# EAGLE design PhotonIoTv2 (EAGLE 7.6.0)
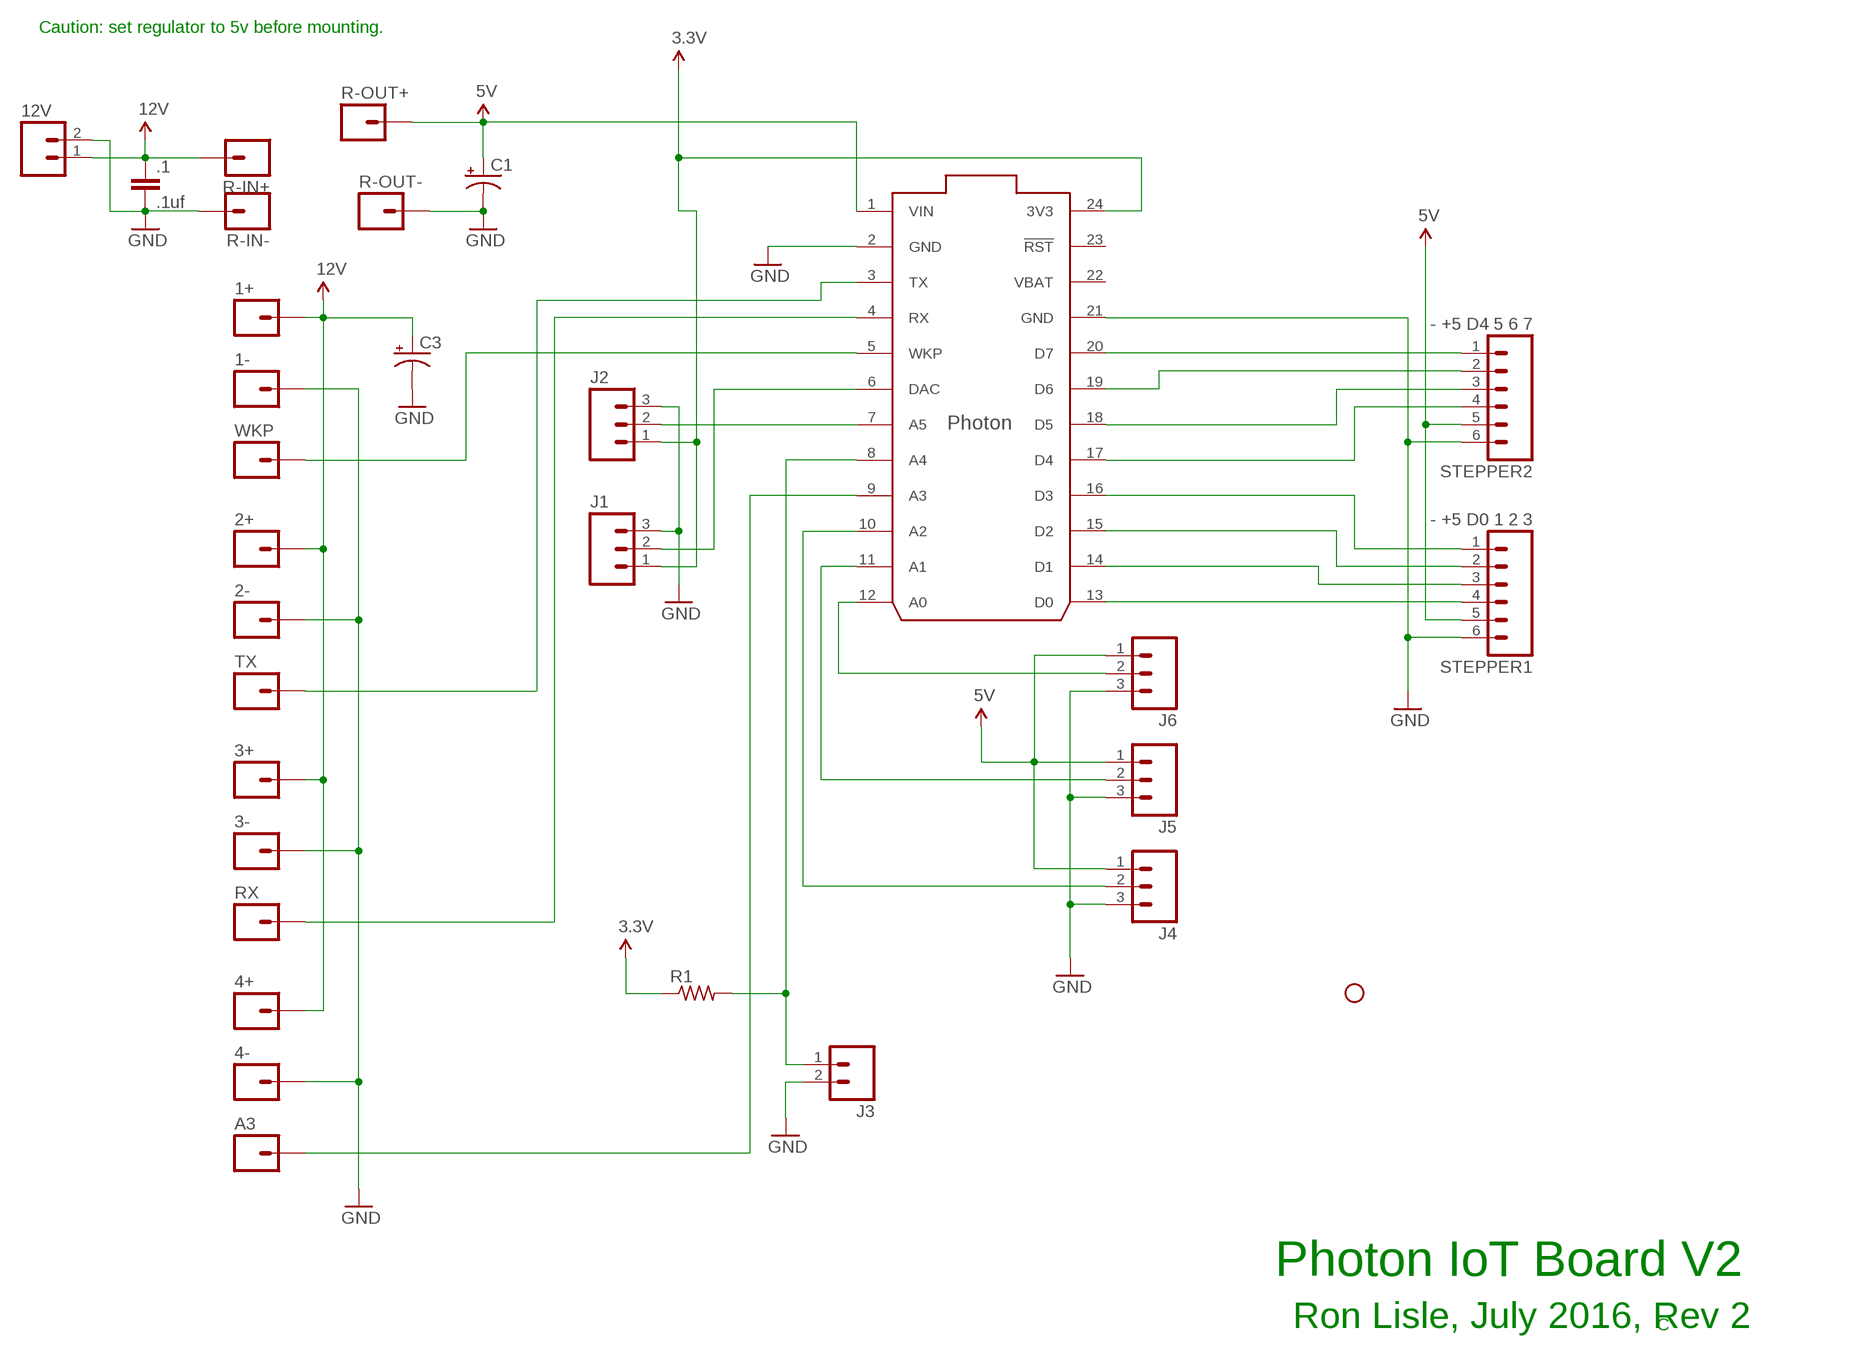
[diagram p0: schematic, sheet 1]

## Parts
1+  M01PTH  [1X01]
1-  M01PTH  [1X01]
2+  M01PTH  [1X01]
2-  M01PTH  [1X01]
3+  M01PTH  [1X01]
3-  M01PTH  [1X01]
4+  M01PTH  [1X01]
4-  M01PTH  [1X01]
12V  M025MM  [SCREWTERMINAL-5MM-2]
.1  .1uf  0.1UF-50V-20%(PTH)KIT-EZ  [CAP-PTH-SMALL-KIT]
A3  M01PTH  [1X01]
C1  10UF-25V-20%(PTH)KIT  [CPOL-RADIAL-10UF-25V-KIT]
C3  10UF-25V-20%(PTH)KIT  [CPOL-RADIAL-10UF-25V-KIT]
J1  M03PTH  [1X03]
J2  M03PTH  [1X03]
J3  M02PTH  [1X02]
J4  M03PTH  [1X03]
J5  M03PTH  [1X03]
J6  M03PTH  [1X03]
R1  R-US_0204/7  [0204/7]
R-IN+  M01PTH  [1X01]
R-IN-  M01PTH  [1X01]
R-OUT+  M01PTH  [1X01]
R-OUT-  M01PTH  [1X01]
RX  M01PTH  [1X01]
STANDOFF1  STAND-OFF  [STAND-OFF]
STEPPER1  - +5 D0 1 2 3  M06LOCK_LONGPADS  [1X06_LOCK_LONGPADS]
STEPPER2  - +5 D4 5 6 7  M06LOCK_LONGPADS  [1X06_LOCK_LONGPADS]
TX  M01PTH  [1X01]
U$1  Photon with headers  PHOTON_WITH_HEADERS  [PHOTON]
WKP  M01PTH  [1X01]

## Nets
3.3V: J1.1 J2.1 R1.1 U$1.24(3V3)
5V: C1.1(+) J4.1 J5.1 J6.1 R-OUT+.1 STEPPER1.5 STEPPER2.5 U$1.1(VIN)
12V: 1+.1 2+.1 3+.1 4+.1 12V.1 .1.1 C3.1(+) R-IN+.1
GND: 1-.1 2-.1 3-.1 4-.1 12V.2 .1.2 C1.2(-) C3.2(-) J1.3 J2.3 J3.2 J4.3 J5.3 J6.3 R-IN-.1 R-OUT-.1 STEPPER1.6 STEPPER2.6 U$1.2(GND) U$1.21(GND)
N$2: STEPPER1.2 U$1.15(D2)
N$3: STEPPER2.1 U$1.20(D7)
N$4: STEPPER2.3 U$1.18(D5)
N$5: STEPPER2.4 U$1.17(D4)
N$6: STEPPER1.1 U$1.16(D3)
N$7: A3.1 U$1.9(A3)
N$8: J4.2 U$1.10(A2)
N$9: STEPPER1.3 U$1.14(D1)
N$10: STEPPER1.4 U$1.13(D0)
N$11: U$1.5(WKP) WKP.1
N$12: J3.1 R1.2 U$1.8(A4)
N$13: J2.2 U$1.7(A5)
N$14: STEPPER2.2 U$1.19(D6)
N$15: J5.2 U$1.11(A1)
N$16: J6.2 U$1.12(A0)
N$17: J1.2 U$1.6(DAC)
N$18: TX.1 U$1.3(TX)
N$19: RX.1 U$1.4(RX)
Unconnected: U$1.23(!RST)

## Notes on the sheet
- Caution: set regulator to 5v before mounting.
- Photon IoT Board V2
- Ron Lisle, July 2016, Rev 2 | C

## Power pins joined to a net without a drawn wire
VBAT: U$1.22(VBAT)

## Library data of the parts
1+ 1- 2+ 2- 3+ 3- 4+ 4- A3 R-IN+ R-IN- R-OUT+ R-OUT- RX TX WKP = Ron:M01: Header 1 Standard 1-pin 0.1" header. Use with straight break away headers (SKU : PRT-00116), right angle break away headers (PRT-00553), swiss pins (PRT-00743), machine pins (PRT-00117), and female headers (PRT-00115). SMTSO-256-ET is a "flush mount" nut for a 4-40 screw. The older package used to be too tight, and did not allow it to sit properly thru the drill hit. The latest (0.165DIA) fits nice and snug.
12V = Ron:M02: Standard 2-pin 0.1" header. Use with - straight break away headers ( PRT-00116) - right angle break away headers (PRT-00553) - swiss pins (PRT-00743) - machine pins (PRT-00117) - female headers (PRT-00115) Molex polarized connector foot print use with: PRT-08233 with associated crimp pins and housings. 2.54_SCREWTERM for use with PRT-10571. 3.5mm Screw Terminal footprints for PRT-08084 5mm Screw Terminal footprints for use with PRT-08432; STOREFRONT_ID: PRT-08432
.1 = Ron:0.1UF-50V-20%(PTH): CAP-08370; PROD_ID: CAP-08370
C1 C3 = Ron:10UF-25V-20%(PTH): CAP-08440; PROD_ID: CAP-08440
J1 J2 J4-J6 = Ron:M03: Header 3 Standard 3-pin 0.1" header. Use with straight break away headers (SKU : PRT-00116), right angle break away headers (PRT-00553), swiss pins (PRT-00743), machine pins (PRT-00117), and female headers (PRT-00115). Molex polarized connector foot print use with SKU : PRT-08232 with associated crimp pins and housings.
J3 = Ron:M02: Standard 2-pin 0.1" header. Use with - straight break away headers ( PRT-00116) - right angle break away headers (PRT-00553) - swiss pins (PRT-00743) - machine pins (PRT-00117) - female headers (PRT-00115) Molex polarized connector foot print use with: PRT-08233 with associated crimp pins and housings. 2.54_SCREWTERM for use with PRT-10571. 3.5mm Screw Terminal footprints for PRT-08084 5mm Screw Terminal footprints for use with PRT-08432
R1 = resistor:R-US_: RESISTOR, American symbol
STANDOFF1 = Ron:STAND-OFF: #4 Stand Off This is the mechanical footprint for a #4 phillips button head screw. Use the keepout ring to avoid running the screw head into surrounding components. SKU : PRT-00447
STEPPER1 STEPPER2 = Ron:M06: Header 6 Standard 6-pin 0.1" header. Use with straight break away headers (SKU : PRT-00116), right angle break away headers (PRT-00553), swiss pins (PRT-00743), machine pins (PRT-00117), and female headers (PRT-00115). Molex polarized connector foot print use with SKU : PRT-08094 with associated crimp pins and housings. NOTES ON THE VARIANTS LOCK and LOCK_LONGPADS... This footprint was designed to help hold the alignment of a through-hole component (i.e. 6-pin header) while soldering it into place. You may notice that each hole has been shifted either up or down by 0.005 of an inch from it's more standard position (which is a perfectly straight line). This slight alteration caused the pins (the squares in the middle) to touch the edges of the holes. Because they are alternating, it causes a "brace" to hold the component in place. 0.005 has proven to be the perfect amount of "off-center" position when using our standard breakaway headers. Although looks a little odd when you look at the bare footprint, once you have a header in there, the alteration is very hard to notice. Also,if you push a header all the way into place, it is covered up entirely on the bottom side. This idea of altering the position of holes to aid alignment will be further integrated into the Sparkfun Library for other footprints. It can help hold any component with 3 or more connection pins.
U$1 = Spark:PHOTON

## Board
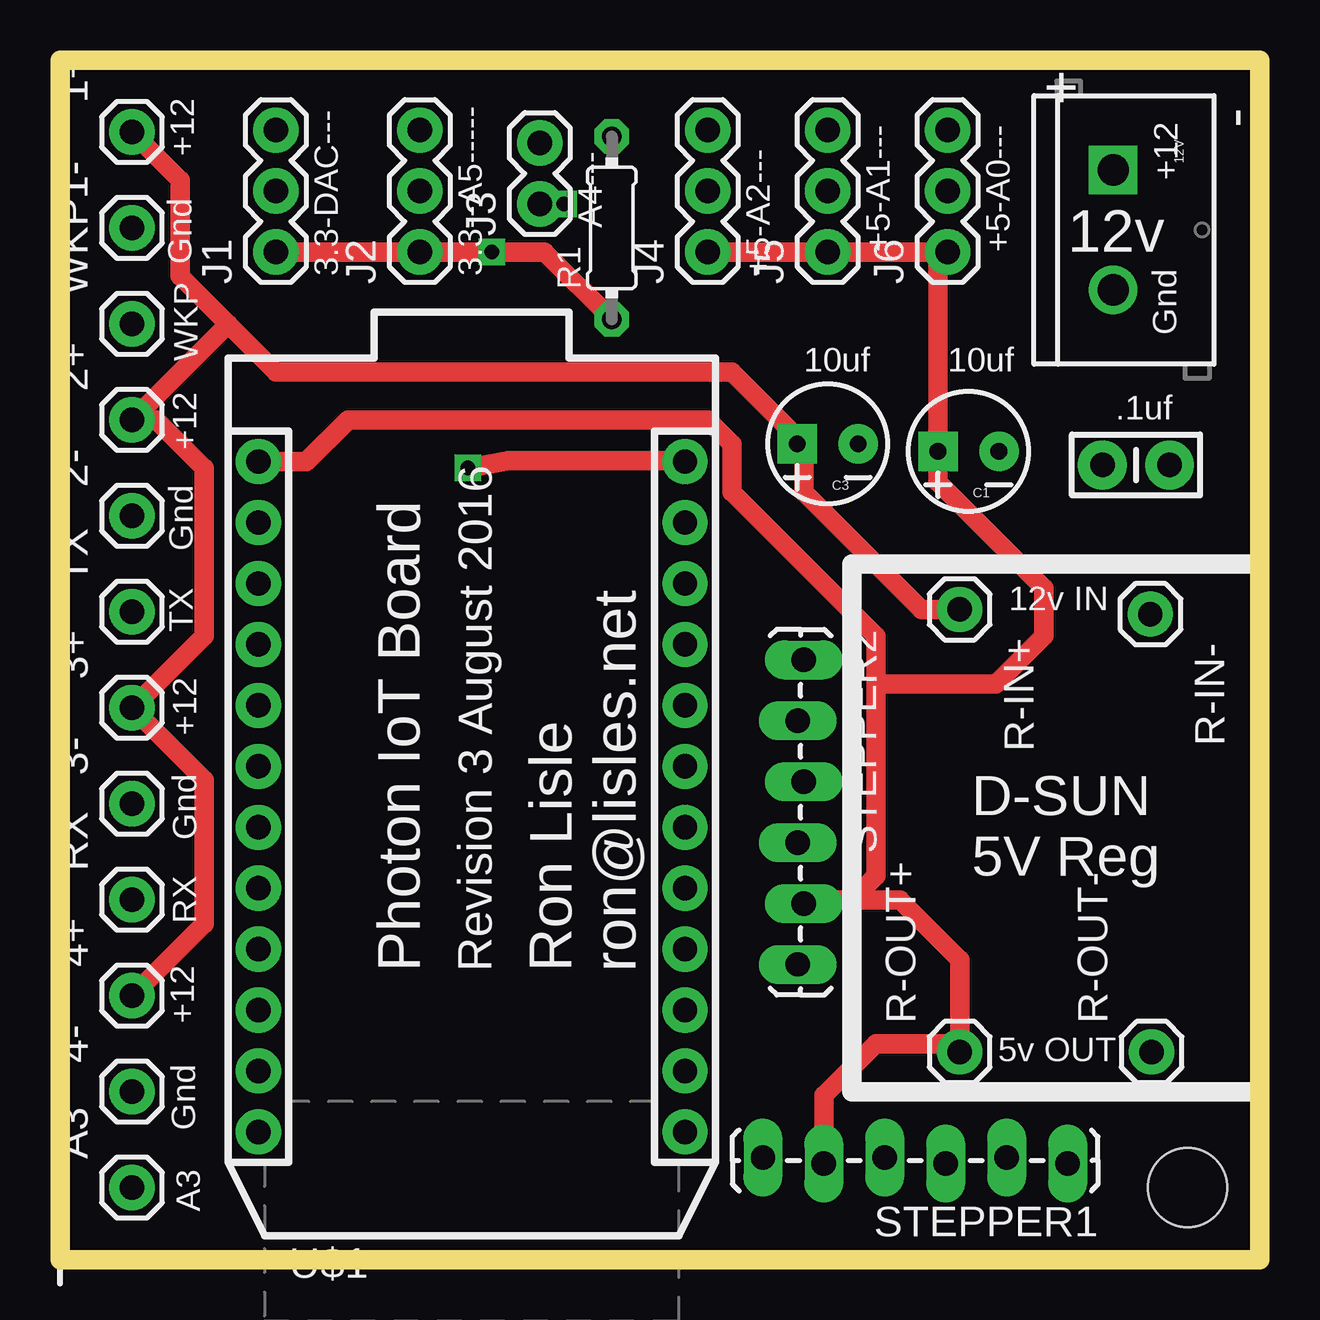
[diagram p1: board, top side]
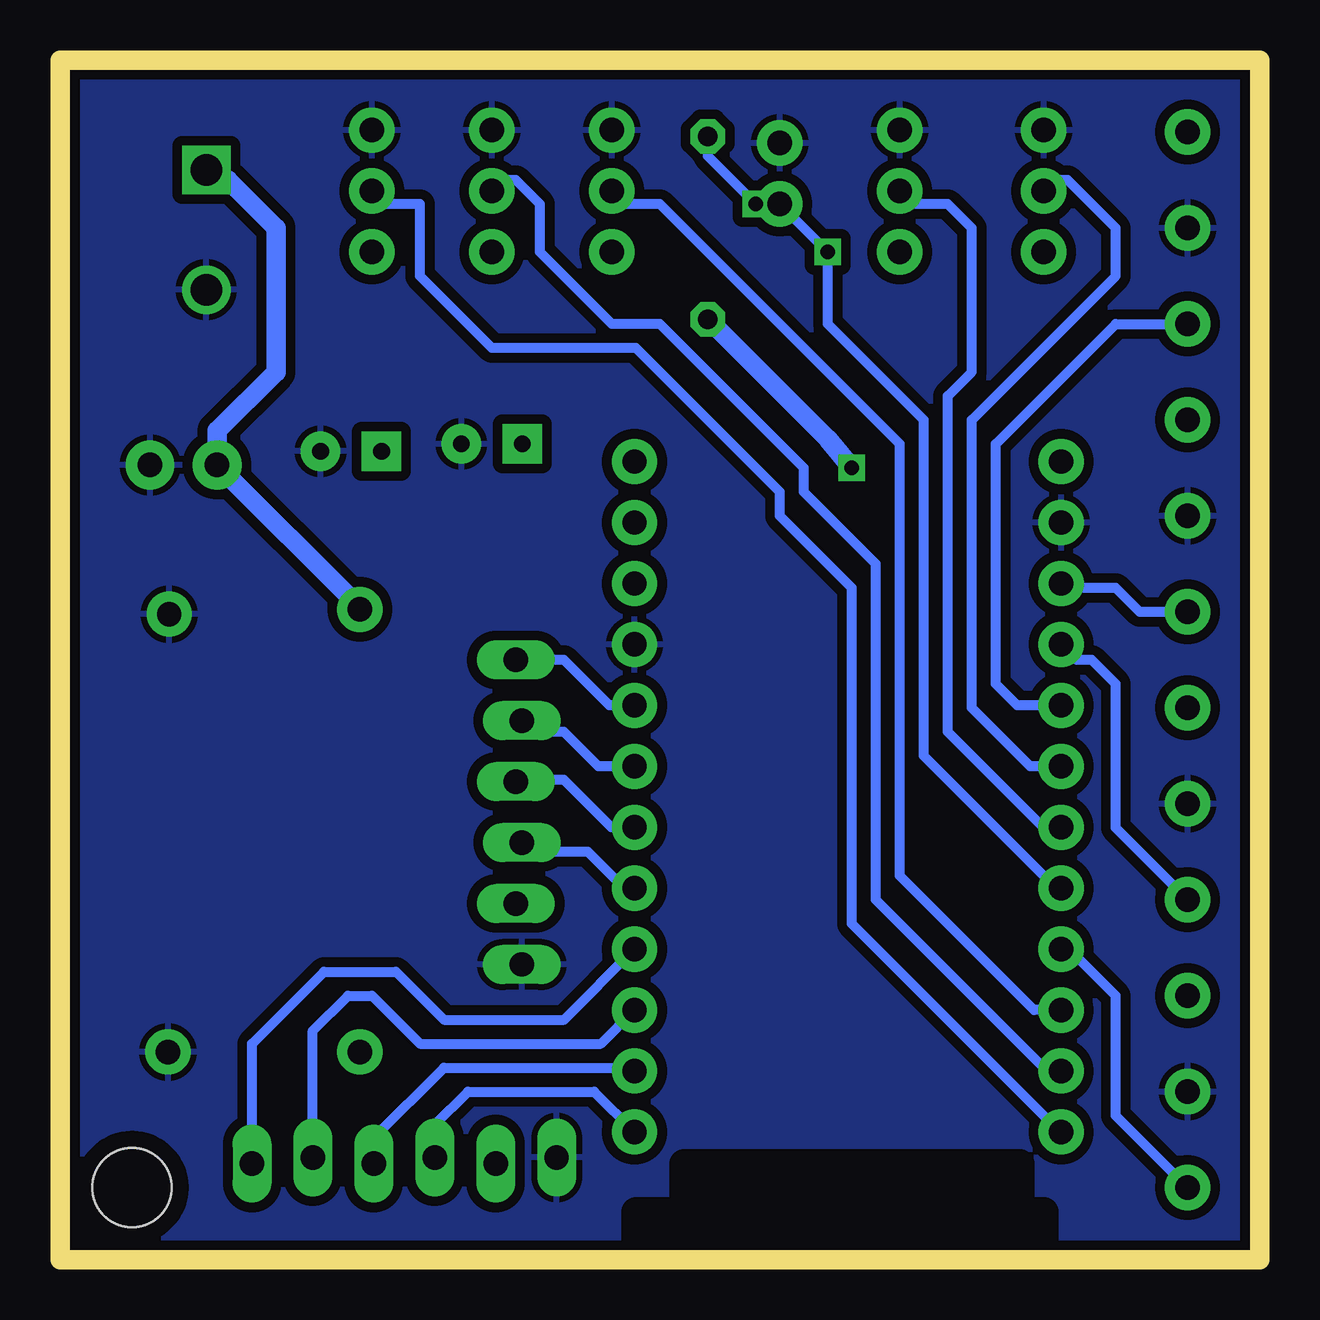
[diagram p2: board, bottom side, seen from below]

Size 50 x 50 mm. Coordinates in mm from the lower left corner, seen from the top.
Outline: 0,50 50,50 50,0 0,0 0,50
Copper layers (1*16): Top 0.035mm / dielectric 1.5mm / Bottom 0.035mm
Design rules "SparkFun": minimum track width 8mil, minimum drill 20mil, track to track 8mil, track to pad 8mil, pad to pad 8mil, via to via 8mil, smd to smd 8mil, copper to edge 8mil, drill to drill 8mil, minimum pad ring 12mil, minimum via ring 10mil, stop-mask expansion 4mil, vias tented up to drill 20mil, thermal gap 10mil
bKeepout: area 24,0 to 27,2
tRestrict: area 9,0 to 26,4
bRestrict: area 9,0 to 26,4

### Footprints (pad centres in the part's own frame; a part is rotated, then mirrored left to right if it is on the bottom)
1X01 = drill 1.016 pad 1.88: 1 0,0
SCREWTERMINAL-5MM-2 = drill 1.3 pad 2.032 square: 1 0,0 | drill 1.3 pad 2.032: 2 5,0
CAP-PTH-SMALL-KIT = drill 1.016 pad 2.032: 1 -1.397,0; 2 1.397,0
CPOL-RADIAL-10UF-25V-KIT = drill 0.7 pad 1.651 square: 1 1.27,0 | drill 0.7 pad 1.651: 2 -1.27,0
1X03 = drill 1.016 pad 1.88: 1 0,0; 2 2.54,0; 3 5.08,0
1X02 = drill 1.016 pad 1.88: 1 0,0; 2 2.54,0
0204/7 = drill 0.813 octagon: 1 -3.81,0; 2 3.81,0
STAND-OFF = hole 3.302: 0,0
1X06_LOCK_LONGPADS = drill 1.016 long: 1 0,0; 2 2.54,-0.254; 3 5.08,0; 4 7.62,-0.254; 5 10.16,0; 6 12.7,-0.254
PHOTON = drill 1.016 pad 1.88: 1 1.27,32.258; 2 1.27,29.718; 3 1.27,27.178; 4 1.27,24.638; 5 1.27,22.098; 6 1.27,19.558; 7 1.27,17.018; 8 1.27,14.478; 9 1.27,11.938; 10 1.27,9.398; 11 1.27,6.858; 12 1.27,4.318; 13 19.05,4.318; 14 19.05,6.858; 15 19.05,9.398; 16 19.05,11.938; 17 19.05,14.478; 18 19.05,17.018; 19 19.05,19.558; 20 19.05,22.098; 21 19.05,24.638; 22 19.05,27.178; 23 19.05,29.718; 24 19.05,32.258

### Placement (x,y rotation side)
1+  3,47 90 top
1-  3,43 90 top
2+  3,35 90 top
2-  3,31 90 top
3+  3,23 90 top
3-  3,19 90 top
4+  3,11 90 top
4-  3,7 90 top
12V  43.9,45.42 270 top
.1  44.85,33.12 0 top
A3  3,3 90 top
C1  37.87,33.69 180 top
C3  32,34 180 top
J1  9,42 90 top
J2  15,42 90 top
J3  20,44 90 top
J4  27,42 90 top
J5  32,42 90 top
J6  37,42 90 top
R1  23,43 90 top
R-IN+  37.5,27.1 270 top
R-IN-  45.45,26.9 270 top
R-OUT+  37.5,8.65 90 top
R-OUT-  45.5,8.65 90 top
RX  3,15 90 top
STANDOFF1  47,3 0 top
STEPPER1  42,4 180 top
STEPPER2  31,25 270 top
TX  3,27 90 top
U$1  7,1 0 top
WKP  3,39 90 top

### Tracks (layer width: path | path; a pad name or v marks a point on that pad's centre or on a via)
3.3V  (via drill 0.6)
  Top 0.813: J1.1 J2.1 20.19,42 R1.1 23,39 | U$1.24 26,33.31 18.69,33.31 v17,33
  Bottom 0.813: v17,33 18,34.19 R1.1
5V
  Top 0.813: J4.1 J5.1 J6.1 36.6,41.6 C1.1 36.6,32.4 41,28 41,26 39,24 34,24 | STEPPER1.5 31.84,6.84 34,9 37.15,9 R-OUT+.1 37.5,12.5 35,15 33,15 | 33,15 31.16,15 STEPPER2.5 | U$1.1 10.26,33.26 12,35 27,35 28,34 28,32 34,26 34,24 | 34,24 34,16 33,15
12V
  Top 0.813: R-IN+.1 35.9,27.1 31,32 31,33.73 C3.1 30.73,34.27 28,37 9,37 7,39 | 1+.1 5,45 5,41 7,39 | 7,39 2+.1 4,35 6,33 6,26 3+.1 6,20 6,14 4+.1
  Bottom 0.813: R-IN+.1 37.5,27.17 .1.1 43.45,34.55 41,37 41,43 43,45 43.48,45 12V.1
GND
  pour Bottom (isolate 0.406): 0,50 50,50 50,0 0,0
N$2
  Bottom 0.406: STEPPER1.2 39.46,9.54 38,11 37,11 35,9 27.45,9 U$1.15
N$3
  Bottom 0.406: U$1.20 27.1,23.1 29,25 STEPPER2.1
N$4
  Bottom 0.406: U$1.18 27.02,18.02 29,20 30.92,20 STEPPER2.3
N$5
  Bottom 0.406: U$1.17 26.48,15.48 28,17 30.37,17 STEPPER2.4
N$6
  Bottom 0.406: STEPPER1.1 42,9 39,12 36,12 34,10 28.99,10 U$1.16
N$7
  Bottom 0.406: A3.1 6,6 6,11 8,13 8.21,13 U$1.9
N$8
  Bottom 0.406: U$1.10 9.4,10.4 15,16 15,34 25,44 26.46,44 J4.2
N$9
  Bottom 0.406: STEPPER1.3 36.92,5.08 34,8 26.19,8 U$1.14
N$10
  Bottom 0.406: STEPPER1.4 34.38,5.62 33,7 27.73,7 U$1.13
N$11
  Bottom 0.406: U$1.5 10.1,23.1 11,24 11,34 6,39 WKP.1
N$12  (via drill 0.6)
  Bottom 0.406: U$1.8 8.48,15.48 14,21 14,35 18,39 v18,42 J3.1 v21,44 23,46 R1.2
N$13
  Bottom 0.406: U$1.7 9.02,18.02 13,22 13,36 12,37 12,43 13,44 14.46,44 J2.2
N$14
  Bottom 0.406: U$1.19 27.56,20.56 29,22 30.29,22 STEPPER2.2
N$15
  Bottom 0.406: U$1.11 8.86,7.86 16,15 16,29 19,32 19,33 25,39 27,39 30,42 30,44 31,45 31.54,45 J5.2
N$16
  Bottom 0.406: U$1.12 8.32,5.32 17,14 17,28 20,31 20,32 26,38 32,38 35,41 35,44 36.46,44 J6.2
N$17
  Bottom 0.406: U$1.6 9.56,20.56 12,23 12,35 6,41 6,43 8,45 8.54,45 J1.2
N$18
  Bottom 0.406: TX.1 5,27 6,28 8.09,28 U$1.3
N$19
  Bottom 0.406: RX.1 6,18 6,24 7,25 7.63,25 U$1.4

### Text on the board
tPlace: + | - | +12 | +12 | A4--- | Gnd | +5-A1--- | +5-A0--- | 12v | 3.3-DAC--- | 3.3--A5----- | +5-A2--- | Gnd | WKP | 10uf | 10uf | .1uf | +12 | Gnd | 12v IN | TX | +12 | Gnd | D-SUN / 5V Reg | RX | Photon IoT Board | Revision 3 August 2016 | Ron Lisle / ron@lisles.net | +12 | 5v OUT | Gnd | A3